# Altium schematic sheet power_supply.SchDoc
size A4
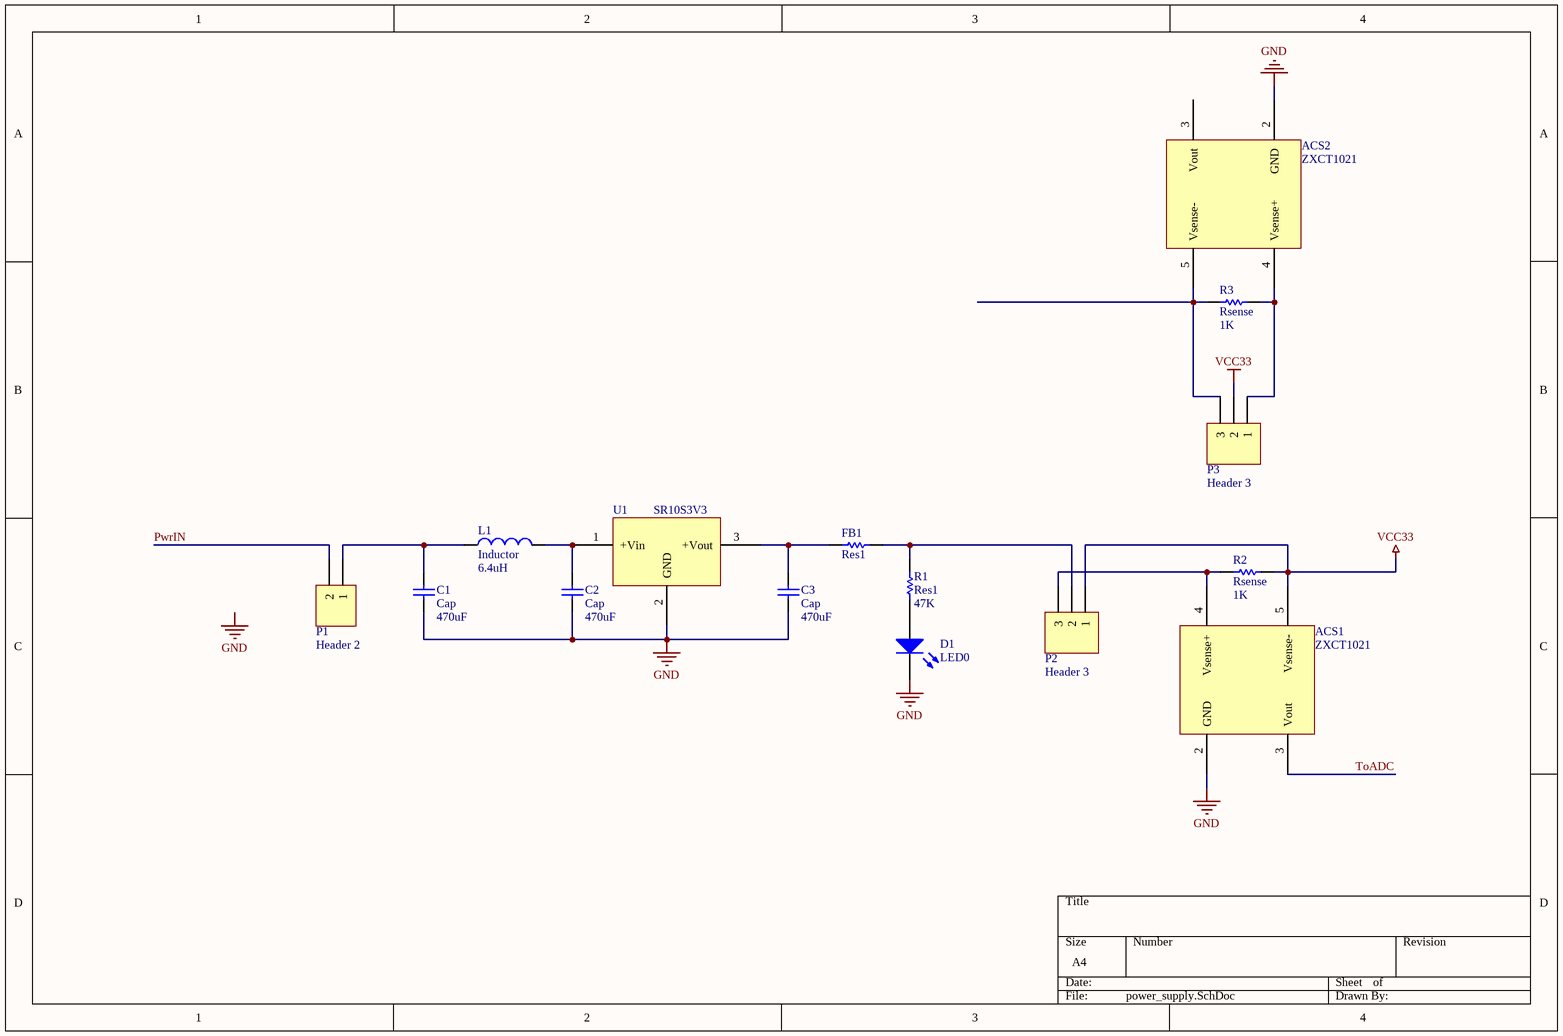
[diagram p0: power_supply.SchDoc]

## Parts
ACS1  ZXCT1021
ACS2  ZXCT1021
C1  Cap  value 470uF  [RAD-0.3]
C2  Cap  value 470uF  [RAD-0.3]
C3  Cap  value 470uF  [RAD-0.3]
D1  LED0  [LED-0]
FB1  Res1  [AXIAL-0.3]
L1  Inductor  value 6.4uH  [0402-A]
P1  Header 2  [HDR1X2]
P2  Header 3  [HDR1X3]
P3  Header 3  [HDR1X3]
R1  Res1  value 47K  [AXIAL-0.3]
R2  Rsense  value 1K  [AXIAL-0.3]
R3  Rsense  value 1K  [AXIAL-0.3]
U1  SR10S3V3  [SR10S3V3_Footprint]

## Nets
GND: ACS1.2(GND) ACS2.2(GND) C1.1 C2.1 C3.1 D1.2(K) U1.2(GND)
VCC33: ACS1.5(Vsense-) P2.1 P3.2 R2.1
PwrIN: P1.2
ToADC: ACS1.3(Vout)
NetACS1_4: ACS1.4(Vsense+) P2.3 R2.2
NetACS2_4: ACS2.4(Vsense+) P3.1 R3.1
NetACS2_5: ACS2.5(Vsense-) P3.3 R3.2
NetC1_2: C1.2 L1.1 P1.1
NetC2_2: C2.2 L1.2 U1.1(+Vin)
NetC3_2: C3.2 FB1.1 U1.3(+Vout)
NetD1_1: D1.1(A) R1.1
NetFB1_2: FB1.2 P2.2 R1.2

Not connected (* = marked no-connect by the designer): ACS2 3(Vout)

## Notes on the sheet
- Labels drawn without touching a wire or pin: GND

## Library data of the parts
C1-C3 = Cap: Capacitor; Published: 8-Jun-2000; LatestRevisionDate: 17-Jul-2002; LatestRevisionNote: Re-released for DXP Platform.; PackageReference: RAD-0.3; Publisher: Altium Limited; PackageDescription: Radial Cap, Thru-Hole; 2 Leads; 0.3 in Pin Spacing
D1 = LED0: Typical INFRARED GaAs LED; Published: 8-Jun-2000; LatestRevisionDate: 08-Jul-2005; LatestRevisionNote: Mech Layer 1 removed.; PackageReference: LED-0; Publisher: Altium Limited; PackageDescription: LED; 2 Leads
FB1 = Res1: Resistor; Value: 1K; Published: 8-Jun-2000; LatestRevisionDate: 17-Jul-2002; LatestRevisionNote: Re-released for DXP Platform.; PackageReference: AXIAL-0.3; Publisher: Altium Limited; PackageDescription: Axial Device, Thru-Hole; 2 Leads; 0.3 in Pin Spacing
L1 = Inductor: Code_IEC: 1005; Published: 8-Jun-2000; LatestRevisionDate: 29-May-2009; LatestRevisionNote: IPC-7351 Footprint Added.; PackageReference: 0402-A; Publisher: Altium Limited; PackageDescription: Chip Inductor; Code_JEITA: 0402
P1 = Header 2: Header, 2-Pin; LatestRevisionDate: 17-Jul-2002; LatestRevisionNote: Re-released for DXP Platform.; Publisher: Altium Limited
P2 P3 = Header 3: Header, 3-Pin; LatestRevisionDate: 17-Jul-2002; LatestRevisionNote: Re-released for DXP Platform.; Publisher: Altium Limited
R1-R3 = Res1: Resistor; Published: 8-Jun-2000; LatestRevisionDate: 17-Jul-2002; LatestRevisionNote: Re-released for DXP Platform.; PackageReference: AXIAL-0.3; Publisher: Altium Limited; PackageDescription: Axial Device, Thru-Hole; 2 Leads; 0.3 in Pin Spacing